# EasyEDA Pro project ProPrj_Retro-boy-color_2026-08-08.epro, board PCB_V2
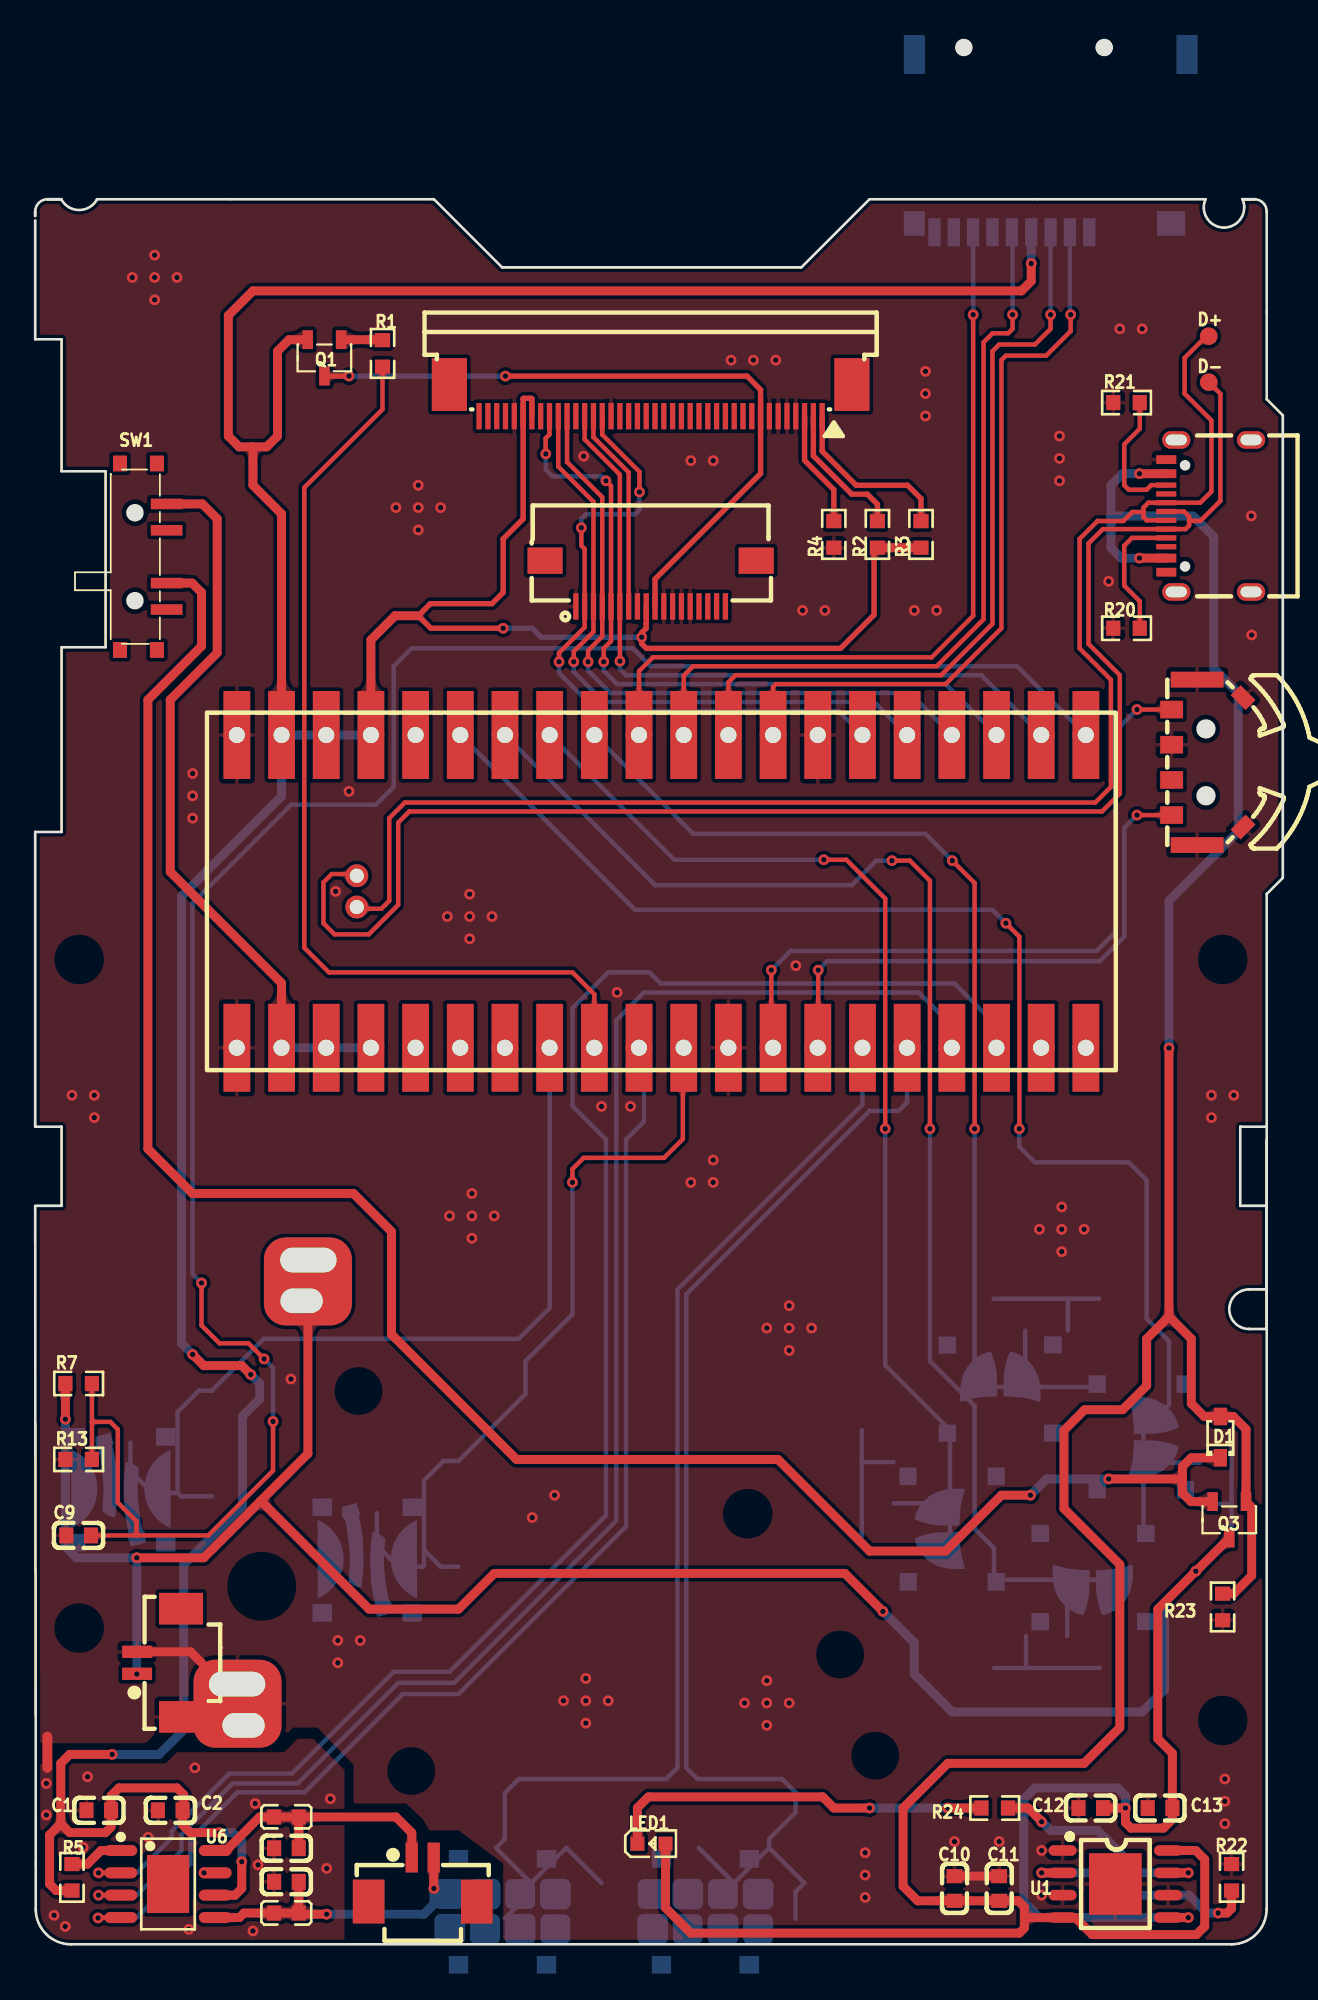
[diagram p4: board, top side]
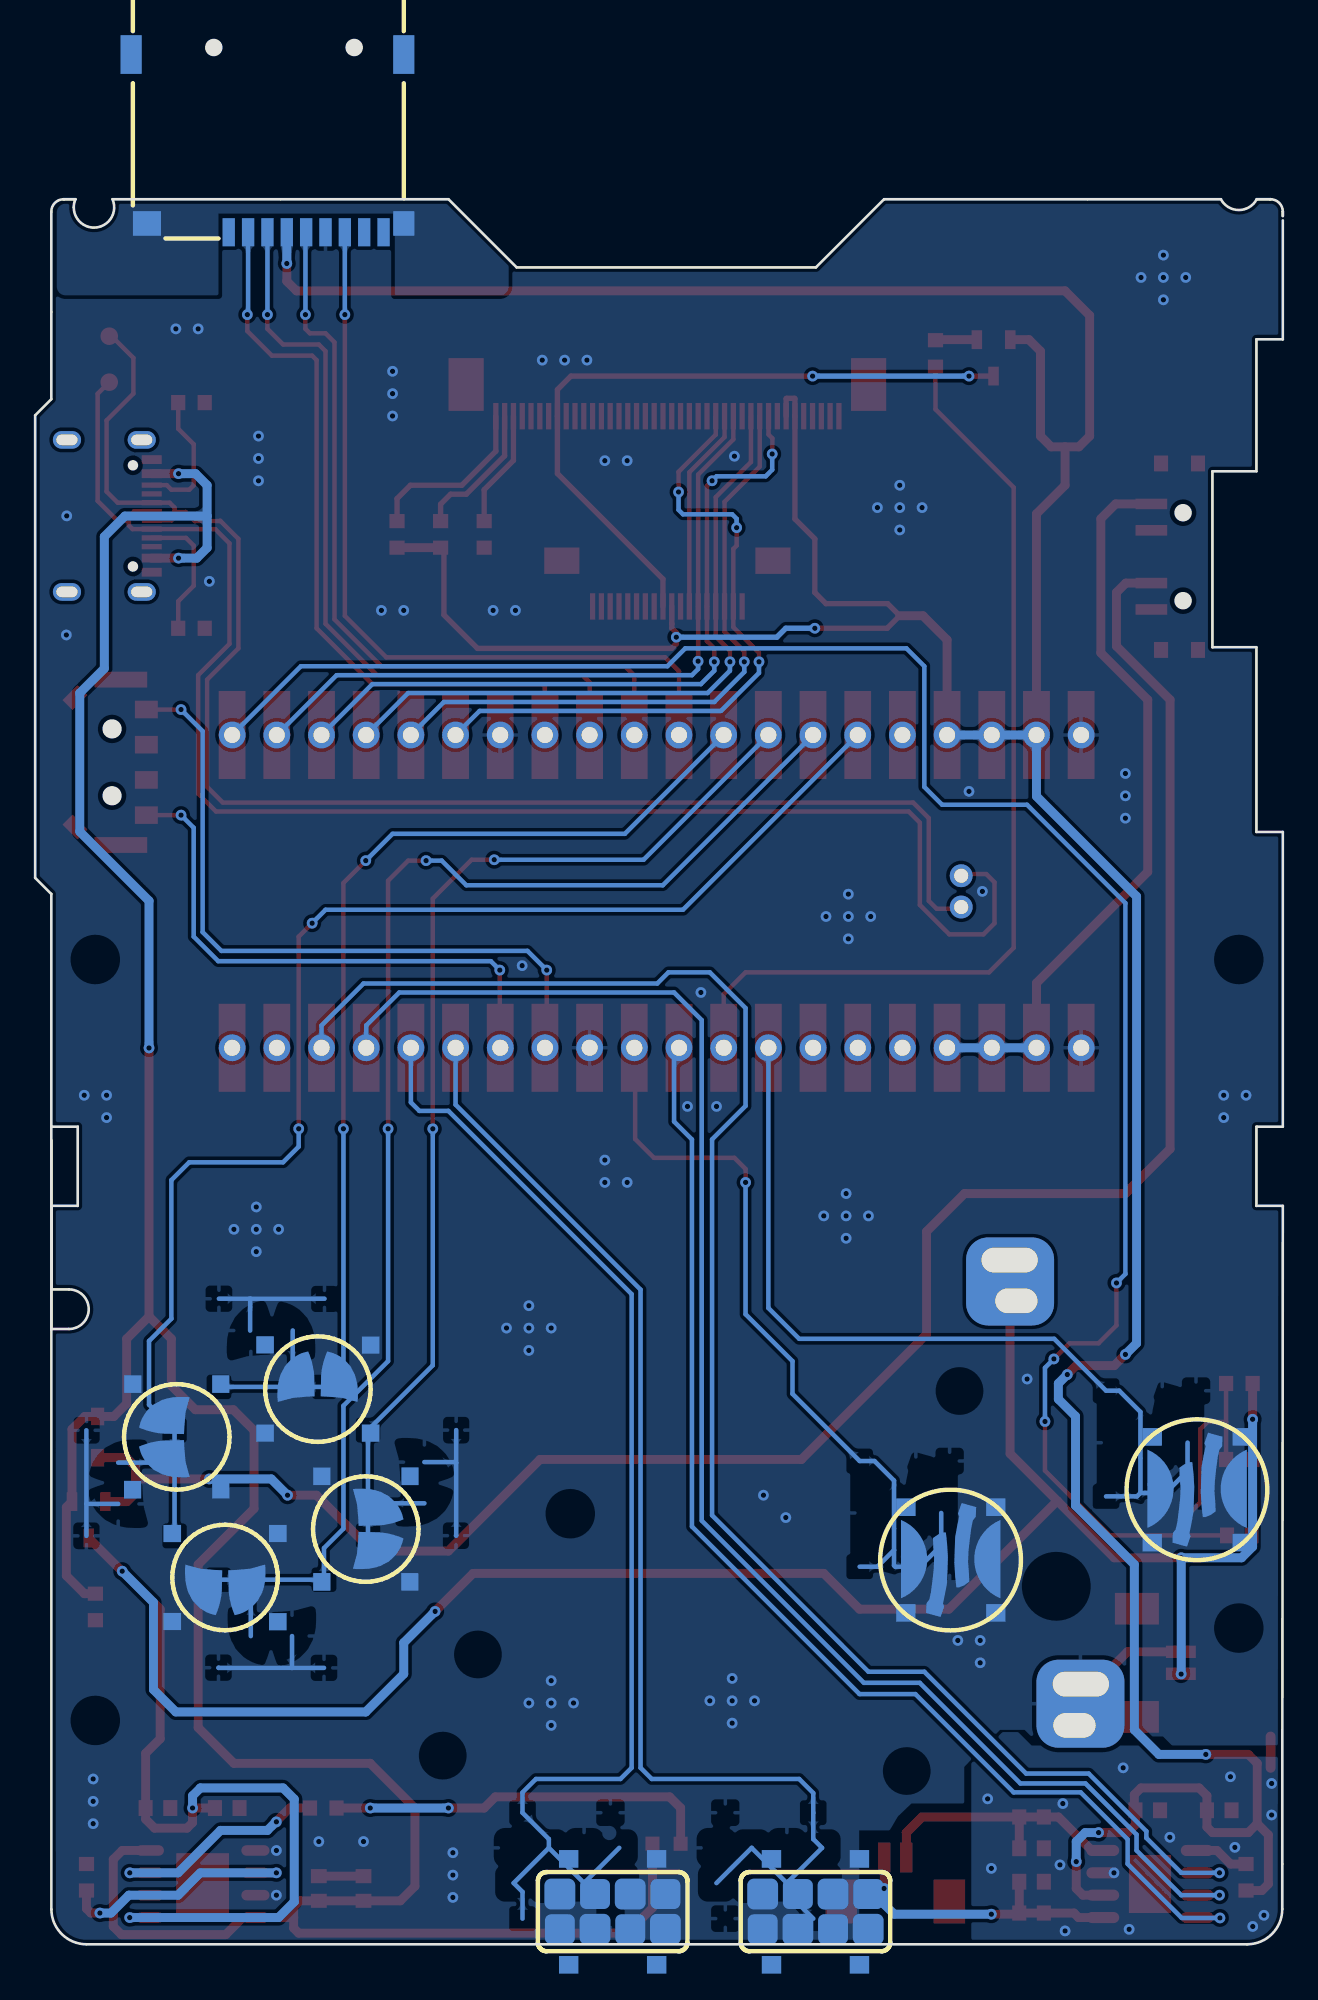
[diagram p5: board, bottom side, seen from below]

Outline 70.92 x 108.31 mm; copper layers: Top Layer, Bottom Layer. Coordinates in mm from the lower left corner of the outline.
Outline path: 0,98.49 0,98.23 0,98.49 ; 0,98.49 arc(0.21,98.98) 0.7,99.19 ; 0.7,99.19 1.48,99.19 ; 0.7,99.19 1.48,99.19 ; 0,97.98 0,91.22 1.5,91.22 1.5,83.72 4,83.72 4,73.72 1.5,73.72 1.5,63.22 0,63.22 0,46.47 1.5,46.47 1.5,41.97 0,41.97 0.03,4.57 0.03,2 arc(0.62,0.59) 2.03,0 68,0 arc(69.41,0.59) 70,2 70,45.7 ; 1.48,99.19 arc(2.5,98.57) 3.52,99.19 22.66,99.19 26.54,95.31 43.55,95.31 47.42,99.19 66.52,99.19 arc(67.34,97.6) 68.73,98.72 arc(68.7,98.96) 68.63,99.19 ; 70,46.47 68.5,46.47 68.5,41.97 70,41.97 70,37.22 69,37.22 arc(67.88,36.1) 69,34.97 70,34.97 70,59.7 70.92,60.62 70.92,86.91 70,87.82 70,98.49 arc(69.79,98.98) 69.3,99.19 ; 68.63,99.19 69.3,99.19 ; 68.63,99.19 69.3,99.19
Stack: Top Layer 0.035mm / Dielectric1 1.51mm FR4 er 4.5 / Bottom Layer 0.035mm

## Design rules (mm)
spacing copperThickness1oz (default): track to track 0.102, other pairs 0.152 to 0.3
spacing copperThickness2oz: track to track 0.203, other pairs 0.152 to 0.3
spacing Plane_innerPlane: track to track 0.102, other pairs 0.152 to 0.3
spacing Copper_copperRegion: track to track 0.102, other pairs 0.152 to 0.3
spacing Copper_加固: track to track 0.102, other pairs 0.152 to 0.3
track width copperThickness1oz (default): min 0.127, default 0.254, max 2.54
track width copperThickness2oz: min 0.203, default 0.254, max 2.54
differential pair differentialPair (default): width min 0.127, default 0.254, max 2.54; gap min 0.152, default 0.152
net FIXED uses 加固
pour e961 uses Copper_加固, copperRegion_Copper_加固
pour e963 uses Copper_copperRegion, copperRegion_Copper_copperRegion
pour e979 uses Copper_copperRegion, copperRegion_Copper_copperRegion
pour e981 uses Copper_copperRegion, copperRegion_Copper_copperRegion
pour e1108 uses Copper_copperRegion, copperRegion_Copper_copperRegion

## Placement (name value [footprint] x y rotation side)
C1  10uF  [C0603]  3.61 7.62 180 top
C2  100nF  [C0603]  7.68 7.62 180 top
C3  1nF  [C0603]  14.28 5.46 0 top
C4  1nF  [C0603]  14.28 3.55 0 top
C9  100nF  [C0603]  2.47 23.24 0 top
C10  10uF  [C0603]  52.25 3.17 270 top
C11  100nF  [C0603]  54.79 3.17 270 top
C12  10uF  [C0603]  60 7.75 0 top
C13  100nF  [C0603]  63.94 7.75 0 top
D1  1N5819WS  [SOD-323_L1.8-W1.3-LS2.5-RD]  67.37 28.83 90 top
D+  -  [Test-Point-0.5mm]  66.71 91.4 0 top
D-  -  [Test-Point-0.5mm]  66.71 88.79 0 top
J1  FPC-40贴片座子/间距0.5MM/上接/抽屉式  [FPC-SMD_40P-P0.50_FPC-40-2]  34.98 87.76 180 top
LED1  NCD0603R1  [LED0603-RD_RED]  35.03 5.72 0 top
NOREF  -  [Pad_e182]  18.28 58.96 0 top
NOREF#2  -  [Pad_e179]  15.5 37.67 0 top
NOREF#3  -  [Pad_e173]  15.5 37.67 0 top
NOREF#4  -  [Pad_e175]  15.53 38.89 0 top
NOREF#5  -  [Pad_e181]  18.28 60.74 0 top
NOREF#6  -  [Pad_e177]  11.48 14.79 0 top
NOREF#7  -  [Pad_e174]  11.5 13.68 0 top
NOREF#8  -  [Pad_e178]  11.84 12.44 0 top
NOREF#9  -  [Pad_e180]  11.5 13.68 0 top
NOREF#10  -  [Pad_e176]  15.14 36.57 0 top
Q1  AO3415  [SOT-23-3_L2.9-W1.4-P1.90-LS2.5-BR]  16.44 90.17 90 top
Q3  AO3415  [SOT-23-3_L2.9-W1.4-P1.90-LS2.5-BR]  67.88 24.13 90 top
R1  1kΩ  [R0603]  19.74 90.42 270 top
R2  10kΩ  [R0603]  47.87 80.14 90 top
R3  10kΩ  [R0603]  50.35 80.14 90 top
R4  10kΩ  [R0603]  45.4 80.14 90 top
R5  10kΩ  [R0603]  2.09 3.81 90 top
R7  10kΩ  [R0603]  2.47 31.88 180 top
R13  10kΩ  [R0603]  2.47 27.56 0 top
R20  5.1kΩ  [R0603]  62.03 74.8 0 top
R21  5.1kΩ  [R0603]  62.03 87.63 0 top
R22  10kΩ  [R0603]  68 3.81 270 top
R23  10kΩ  [R0603]  67.49 19.18 90 top
R24  1kΩ  [R0603]  54.54 7.75 0 top
SW1  MSK13C02-SZ  [SW-SMD_MSK13C02-SZ]  5.95 78.87 270 top
SW1#2  -  [导电橡胶按键#2]  49.5 26.23 270 bottom
SW1#3  -  [导电橡胶按键#2]  57.47 34.18 180 bottom
SW1#4  -  [导电橡胶按键#2]  65.49 26.22 90 bottom
SW1#5  -  [导电橡胶按键#2]  57.5 18.22 0 bottom
SW2  TM-2023  [SW-SMD_TM-2023-1]  66.63 67.18 270 top
SW8  -  [导电橡胶按键]  40.72 4.48 180 bottom
SW8#2  -  [导电橡胶按键]  29.19 4.48 180 bottom
SW8#3  -  [导电橡胶按键#3]  21.5 24.47 180 bottom
SW8#4  -  [导电橡胶按键#3]  7.5 28.47 180 bottom
U1  TP4056X-42-ESOP8  [SOP-8_L4.9-W3.9-P1.27-LS6.0-TL-EP]  61.4 3.43 0 top
U3  FPC-05-18P  [FPC-SMD_18P-P0.50_XW05200-18]  34.98 77.34 180 top
U4  LCKFB-ESP32S3R8N8  [DIP-40_L20.32-W51.66-P2.54-LS15.24]  35.59 59.85 270 top
U5  HX TF-CARD H1.8  [TF-SMD_HX-TF-CARD-H1.8]  57.72 102.36 0 bottom
U6  NS4168  [ESOP-8_L4.9-W3.9-P1.27-LS6.0-BL-EP-1]  7.55 3.43 270 top
U7  ZX-MX1.25-2PWT  [CONN-SMD_2P-P1.25_MEGASTAR_ZX-MX1.25-2PWT]  22.03 3.68 180 top
U8  GBK160808T-102Y-N  [L0603]  14.28 7.24 0 top
U9  GBK160808T-102Y-N  [L0603]  14.28 1.78 0 top
U10  ZX-MX1.25-2PWT  [CONN-SMD_2P-P1.25_MEGASTAR_ZX-MX1.25-2PWT]  7.04 16 270 top
USB3  MC-107DJ  [TYPE-C-SMD_MC-107DJ]  66.7 81.19 90 top

## Footprints (pads in the part's own frame, mm; a bottom-side part is the same pattern mirrored in y, then rotated)
C0603
  rect 0.8x0.9 smd: 1(-0.7,0) 2(0.7,0)
CONN-SMD_2P-P1.25_MEGASTAR_ZX-MX1.25-2PWT
  rect 0.7x1.7 smd: 1(0.625,-1.25) 2(-0.625,-1.25)
  rect 1.8x2.5 smd: 3(-3.075,1.25) 4(3.075,1.25)
DIP-40_L20.32-W51.66-P2.54-LS15.24
  rect 5x1.524 smd: 1(-8.89,24.131) 2(-8.89,21.591) 3(-8.89,19.052) 4(-8.89,16.512) 5(-8.89,13.972) 6(-8.89,11.431) 7(-8.89,8.892) 8(-8.89,6.351) 9(-8.89,3.812) 10(-8.89,1.272) 11(-8.89,-1.268) 12(-8.89,-3.808) 13(-8.89,-6.348) 14(-8.89,-8.889) 15(-8.89,-11.428) 16(-8.89,-13.969) 17(-8.89,-16.509) 18(-8.89,-19.049) 19(-8.89,-21.588) 20(-8.89,-24.128) 21(8.89,-24.128) 22(8.89,-21.588) 23(8.89,-19.049) 24(8.89,-16.509) 25(8.89,-13.969) 26(8.89,-11.428) 27(8.89,-8.889) 28(8.89,-6.348) 29(8.89,-3.808) 30(8.89,-1.268) 31(8.89,1.272) 32(8.89,3.812) 33(8.89,6.351) 34(8.89,8.892) 35(8.89,11.431) 36(8.89,13.972) 37(8.89,16.512) 38(8.89,19.052) 39(8.89,21.591) 40(8.89,24.131)
  round 1.524 hole 0.914: 1(-8.89,24.128) 2(-8.889,21.591) 3(-8.889,19.052) 4(-8.889,16.512) 5(-8.889,13.972) 6(-8.889,11.431) 7(-8.889,8.892) 8(-8.889,6.351) 9(-8.889,3.812) 10(-8.889,1.272) 11(-8.889,-1.268) 12(-8.889,-3.808) 13(-8.889,-6.348) 14(-8.889,-8.889) 15(-8.889,-11.428) 16(-8.889,-13.969) 17(-8.889,-16.509) 18(-8.889,-19.049) 19(-8.889,-21.588) 20(-8.889,-24.128) 21(8.889,-24.131) 22(8.889,-21.591) 23(8.889,-19.052) 24(8.889,-16.512) 25(8.889,-13.972) 26(8.889,-11.431) 27(8.889,-8.892) 28(8.889,-6.351) 29(8.889,-3.812) 30(8.889,-1.272) 31(8.889,1.268) 32(8.889,3.808) 33(8.889,6.348) 34(8.889,8.889) 35(8.889,11.428) 36(8.889,13.969) 37(8.889,16.509) 38(8.889,19.049) 39(8.889,21.588) 40(8.89,24.128)
ESOP-8_L4.9-W3.9-P1.27-LS6.0-BL-EP-1
  oval 0.63x1.865 smd: 1(-1.905,-2.683) 2(-0.635,-2.683) 3(0.635,-2.683) 4(1.905,-2.683) 5(1.905,2.683) 6(0.635,2.683) 7(-0.635,2.683) 8(-1.905,2.683)
  rect 3.3x2.4 smd: 9(0,0)
FPC-SMD_18P-P0.50_XW05200-18
  rect 0.3x1.5 smd: 1(4.25,1.3) 2(3.75,1.3) 3(3.25,1.3) 4(2.75,1.3) 5(2.25,1.3) 6(1.75,1.3) 7(1.25,1.3) 8(0.75,1.3) 9(0.25,1.3) 10(-0.25,1.3) 11(-0.75,1.3) 12(-1.25,1.3) 13(-1.75,1.3) 14(-2.25,1.3) 15(-2.75,1.3) 16(-3.25,1.3) 17(-3.75,1.3) 18(-4.25,1.3)
  rect 2x1.5 smd: 19(-6,-1.3) 20(6,-1.3)
FPC-SMD_40P-P0.50_FPC-40-2
  rect 0.3x1.5 smd: 1(-9.75,0.9) 2(-9.25,0.9) 3(-8.75,0.9) 4(-8.25,0.9) 5(-7.75,0.9) 6(-7.25,0.9) 7(-6.75,0.9) 8(-6.25,0.9) 9(-5.75,0.9) 10(-5.25,0.9) 11(-4.75,0.9) 12(-4.25,0.9) 13(-3.75,0.9) 14(-3.25,0.9) 15(-2.75,0.9) 16(-2.25,0.9) 17(-1.75,0.9) 18(-1.25,0.9) 19(-0.75,0.9) 20(-0.25,0.9) 21(0.25,0.9) 22(0.75,0.9) 23(1.25,0.9) 24(1.75,0.9) 25(2.25,0.9) 26(2.75,0.9) 27(3.25,0.9) 28(3.75,0.9) 29(4.25,0.9) 30(4.75,0.9) 31(5.25,0.9) 32(5.75,0.9) 33(6.25,0.9) 34(6.75,0.9) 35(7.25,0.9) 36(7.75,0.9) 37(8.25,0.9) 38(8.75,0.9) 39(9.25,0.9) 40(9.75,0.9)
  rect 2x3 smd: 41(11.44,-0.9) 42(-11.44,-0.9)
L0603
  rect 0.8x0.864 smd: 1(-0.7,0) 2(0.7,0)
LED0603-RD_RED
  rect 0.8x0.8 smd: 1(-0.799,-0.004) 2(0.799,0.004)
Pad_e173
  custom 0x0 smd far side: 9(0,0)
Pad_e174
  custom 0x0 smd far side: 10(0,0)
Pad_e175
  oval 4x1.8 hole 3.2x1.4: 9(0,0)
Pad_e176
  oval 3x1.8 hole 2.4x1.4: 9(0,0)
Pad_e177
  oval 4x1.8 hole 3.2x1.4: 9(0,0)
Pad_e178
  oval 3x1.8 hole 2.4x1.4: 9(0,0)
Pad_e179
  custom 0x0 smd: 9(0,0)
Pad_e180
  custom 0x0 smd: 10(0,0)
Pad_e181
  round 1.3 hole 0.8: 1(0,0)
Pad_e182
  round 1.3 hole 0.8: 1(0,0)
R0603
  rect 0.806x0.864 smd: 1(-0.753,0) 2(0.753,0)
SOD-323_L1.8-W1.3-LS2.5-RD
  rect 1x0.75 smd: 1(-1.173,0) 2(1.173,0)
SOP-8_L4.9-W3.9-P1.27-LS6.0-TL-EP
  oval 1.6x0.6 smd: 1(-3,1.905) 2(-3,0.635) 3(-3,-0.635) 4(-3,-1.905) 5(3,-1.905) 6(3,-0.635) 7(3,0.635) 8(3,1.905)
  rect 3x3.5 smd: 9(0,0)
SOT-23-3_L2.9-W1.4-P1.90-LS2.5-BR
  rect 1.07x0.6 smd: 1(1.035,-0.95) 2(1.035,0.95) 3(-1.035,0)
SW-SMD_MSK13C02-SZ
  rect 0.6x1.8 smd: 1(-3,1.526) 2(-1.5,1.526) 3(1.5,1.526) 4(3,1.526)
  rect 0.9x0.8 smd: 5(-5.3,0.975) 5(-5.3,-1.125) 6(5.3,0.975) 6(5.3,-1.125)
SW-SMD_TM-2023-1
  rect 1x1.3 smd: 1(-3,-2.03) 2(3,-2.03) C(-1,-2.03) T(1,-2.03)
  rect 0.9x3 smd: 3(-4.7,-0.58) 4(4.7,-0.58)
  rect 1.2x0.8 smd rot 135: 5(3.68,2.03)
  rect 1.2x0.8 smd rot 45: 6(-3.68,2.03)
Test-Point-0.5mm
  round 1 smd: 1(0,0)
TF-SMD_HX-TF-CARD-H1.8
  rect 0.7x1.6 smd: 1(2.2,5.05) 2(1.1,5.05) 3(0,5.05) 4(-1.1,5.05) 5(-2.2,5.05) 6(-3.3,5.05) 7(-4.4,5.05) 8(-5.5,5.05) 9(-6.6,5.05)
  rect 1.2x1.4 smd: 10(-7.75,4.55)
  rect 1.6x1.4 smd: 11(6.85,4.55)
  rect 1.2x2.2 smd: 12(-7.75,-5.05) 13(7.75,-5.05)
TYPE-C-SMD_MC-107DJ
  oval 1x1.6 hole 0.6x1.2: 1(-4.32,1.841) 1(-4.32,-2.409) 1(4.32,1.841) 1(4.32,-2.409)
  rect 0.5x1.14 smd: A1(-3.2,2.409) A4(-2.4,2.409) A9(2.4,2.409) A12(3.2,2.409)
  rect 0.3x1.14 smd: A5(-1.25,2.409) A6(-0.25,2.409) A7(0.25,2.409) A8(1.25,2.409) B5(1.75,2.409) B6(0.75,2.409) B7(-0.75,2.409) B8(-1.75,2.409)
导电橡胶按键
  custom 1.1x1 smd: 1(5.125,0.376) 2(0.126,0.376) 3(5.128,-5.646) 4(0.128,-5.646)
  custom 1.75x1.75 smd: 5(-0.374,-1.624) 7(3.626,-1.624) 10(1.625,-3.624) 12(5.625,-3.624)
  custom 1.7x1.7 smd: 6(1.625,-1.624) 8(5.625,-1.624) 9(-0.374,-3.624) 11(3.626,-3.624)
导电橡胶按键#2
  custom 2.114x2.872 smd: 1(1.442,-1.921) 2(3.785,-1.921)
  custom 1x0.975 smd: 3(-0.375,-0.113) 4(5.625,-0.125) 5(5.625,-5.125) 6(-0.375,-5.125)
导电橡胶按键#3
  custom 1.484x4.457 smd: 1(4.709,-2.579)
  custom 1.24x4.803 smd: 2(3.268,-1.786) 3(2.027,-3.463)
  custom 1.485x4.457 smd: 4(0.541,-2.579)
  custom 1.1x1 smd: 5(0.075,0.375) 6(5.19,0.375) 7(0.075,-5.633) 8(5.19,-5.633)

## Nets
+3V3: C1.1 C2.1 J1.34 J1.35 Q1.2 R2.1 R3.1 R5.1 U3.9 U4.17 U4.18 U4.19 U5.4 U6.6
+5V: SW1.1 U4.22 U4.23 U4.24
+5V_S: D1.1 Q3.2 SW1.3
GND: C1.2 C2.2 C3.1 C4.1 C9.1 C10.1 C11.1 C12.1 C13.1 J1.4 J1.5 J1.6 J1.7 J1.25 J1.36 NOREF#6.9 NOREF#7.10 NOREF#8.9 NOREF#9.10 R4.1 R13.1 R20.1 R21.1 R22.1 R23.1 SW1#2.1 SW1#2.3 SW1#2.4 SW1#3.1 SW1#3.3 SW1#3.4 SW1#4.1 SW1#4.3 SW1#4.4 SW1#5.1 SW1#5.3 SW1#5.4 SW2.3 SW2.4 SW2.5 SW2.6 SW2.C SW8.1 SW8.3 SW8.5 SW8.7 SW8.10 SW8.12 SW8#2.2 SW8#2.4 SW8#2.5 SW8#2.7 SW8#2.10 SW8#2.12 SW8#3.2 SW8#3.4 SW8#3.6 SW8#3.8 SW8#4.2 SW8#4.4 SW8#4.6 SW8#4.8 U1.1 U1.3 U1.6 U1.9 U3.1 U3.8 U3.11 U3.12 U3.13 U3.14 U4.7 U4.20 U4.21 U4.32 U5.6 U6.7 U10.2 U10.4 USB3.A12
VIN: C10.2 C11.2 D1.2 LED1.2 Q3.1 R23.2 U1.4 U1.8 USB3.A4 USB3.A9
18P_X+: U3.17
18P_X-: U3.15
18P_Y+: U3.18
18P_Y-: U3.16
BAT+: C12.2 C13.2 NOREF#2.9 NOREF#3.9 NOREF#4.9 NOREF#10.9 Q3.3 R7.2 U1.5 U10.1
CHIP_PU: U4.16
CS: J1.32 U3.5 U4.3
D/C: J1.30 U3.4 U4.4
DB0: J1.24
DB1: J1.23
DB2: J1.22
DB3: J1.21
DB4: J1.20
DB5: J1.19
DB6: J1.18
DB7: J1.17
DB8: J1.16
DB9: J1.15
DB10: J1.14
DB11: J1.13
DB12: J1.12
DB13: J1.11
DB14: J1.10
DB15: J1.9
FIXED: U5.10 U5.11
GPIO00: U4.25
GPIO01: C9.2 R7.1 R13.2 U4.1
GPIO02: J1.28 U3.6 U4.2
GPIO05: J1.31 U3.3 U4.5
GPIO06: J1.26 U3.2 U4.6
GPIO07: U4.8 U5.2
GPIO08: U4.9 U5.3
GPIO09: U4.10 U5.5
GPIO10: U4.11 U5.7
GPIO11: SW1#3.2 SW1#3.5 SW1#3.6 U4.12
GPIO12: SW1#2.2 SW1#2.5 SW1#2.6 U4.13
GPIO13: SW1#5.2 SW1#5.5 SW1#5.6 U4.14
GPIO14: SW1#4.2 SW1#4.5 SW1#4.6 U4.15
GPIO15: SW8.2 SW8.4 SW8.6 SW8.8 SW8.9 SW8.11 U4.36
GPIO16: SW8#2.1 SW8#2.3 SW8#2.6 SW8#2.8 SW8#2.9 SW8#2.11 U4.35
GPIO17: SW2.2 U4.34
GPIO18: SW2.1 U4.33
GPIO21: SW8#3.1 SW8#3.3 SW8#3.5 SW8#3.7 U4.31
GPIO38: SW8#4.1 SW8#4.3 SW8#4.5 SW8#4.7 U4.28
GPIO39: R1.2 U4.29
GPIO40: U4.30 U6.4
GPIO41: U4.37 U6.3
GPIO42: U4.38 U6.2
GPIO45: U4.39
GPIO46: U4.40
GPIO47: U4.27
GPIO48: U4.26
IM0: J1.3 R4.2
IM1: J1.2 R2.2
IM2: J1.1 R3.2
LEDA: J1.8 Q1.3 U3.10
NS+: C3.2 U6.8 U7.1 U8.1 U8.2
NS-: C4.2 U6.5 U7.2 U9.1 U9.2
RD: J1.29
SDO: J1.27 U3.7
TE: J1.33
USB_D+: D+.1 NOREF.1 USB3.A6 USB3.B6
USB_D-: D-.1 NOREF#5.1 USB3.A7 USB3.B7
X+: J1.38
X-: J1.40
Y+: J1.37
Y-: J1.39
$1N1508: Q1.1 R1.1
$1N4956: R5.2 U6.1
$1N7118: R21.2 USB3.B5
$1N7119: R20.2 USB3.A5
$1N8079: R22.2 U1.2
$1N8081: R24.2 U1.7
$1N8083: LED1.1 R24.1

Pads without a net: J1 41 42; SW1 2 4 5 6; SW2 T; U3 19 20; U5 1 8 9 12 13; U6 9; U7 3 4; U10 3; USB3 1 A1 A8 B8

## Via types
v1: diameter 0.61, hole 0.305, Top Layer to Bottom Layer, 172 vias

## Routing (per net, layer and track width the routed paths; a pad name or vN(x,y) marks a point on that pad's centre or on a via; arc(x,y) is an arc through that point)
+3V3: length 250.4
  Top Layer w0.305: 28.23,86.86 28.23,87.85 28.21,87.87 27.76,87.87 27.73,87.85 27.73,81.01 26.6,79.88 26.6,76.83 25.97,76.2 22.46,76.2 21.77,75.51 22.49,74.8 v1(26.6,74.8) ; U3.9 34.73,75.06 34.73,75.06 34.73,74.8 34.47,74.55 v1(34.47,74.29) 34.47,73.92 34.74,73.66 45.78,73.66 47.68,75.56 47.68,79.19
  Top Layer w0.508: 12.38,85.11 13.16,85.11 13.77,85.72 13.77,90.55 14.43,91.2 Q1.2 ; 12.38,85.11 12.38,82.93 14,81.3 U4.19 ; 12.38,85.11 11.59,85.11 10.98,85.72 10.98,92.58 12.38,93.98 56.06,93.98 56.62,94.53 v1(56.62,95.53) ; v1(12.25,32.38) 11.74,32.89 9.58,32.89 v1(8.95,33.53) ; R5.1 1.19,3.06 0.82,3.43 0.82,6.22 1.45,6.86 ; R2.1 R3.1 ; 1.45,6.86 1.45,10.29 1.96,10.79 v1(4.38,10.79) ; 1.45,6.86 1.96,6.35 3.99,6.35 4.31,6.67 C1.1 4.31,8.45 4.76,8.89 8.06,8.89 8.44,8.51 8.44,7.62 8.38,7.62 8.38,6.79 8.82,6.35 v1(10.47,6.35) ; v1(11.74,4.7) 11.74,3.17 11.36,2.79 U6.6 ; U4.17 19.08,74.14 20.45,75.51 21.77,75.51
  Bottom Layer w0.305: v1(26.6,74.8) 28.25,74.8 28.76,74.29 v1(34.47,74.29)
  Bottom Layer w0.508: v1(4.38,10.79) 7.04,10.79 8.44,12.19 8.44,21.59 11.78,24.93 11.78,30.01 12.76,30.99 12.76,31.88 v1(12.25,32.38) ; v1(56.62,95.53) U5.4 ; v1(11.74,4.7) 11.74,5.84 11.23,6.35 v1(10.47,6.35) ; v1(8.95,33.53) 8.31,34.16 8.31,59.56 14,65.25 U4.19 U4.18 U4.17
+5V: length 42.1
  Top Layer w0.508: U4.22 14,54.64 7.68,60.96 7.68,70.74 10.34,73.4 10.34,81.02 9.5,81.87 SW1.1
  Bottom Layer w0.508: U4.22 U4.23 U4.24
+5V_S: length 114.3
  Top Layer w0.508: 65.21,26.45 v1(61.02,26.45) ; 65.21,26.45 65.21,27.15 65.72,27.66 D1.1 ; 65.21,26.45 65.21,25.65 65.7,25.16 Q3.2 ; v1(56.57,25.53) 54.92,25.53 51.75,22.35 47.43,22.35 42.22,27.56 27.36,27.56 20.25,34.67 20.25,40.51 18.09,42.67 8.95,42.67 6.41,45.21 6.41,70.74 9.46,73.79 9.46,76.83 8.92,77.37 SW1.3
  Bottom Layer w0.508: v1(61.02,26.45) 57.5,26.45 v1(56.57,25.53)
GND: length 39.6
  Top Layer w0.508: C10.1 C11.1 ; 9.46,16 8.83,16.62 U10.2 ; 6.92,7.62 C2.2
  Top Layer w0.559: 0.69,10.03 0.69,11.81
  Bottom Layer w0.254: 66.2,25.03 68.01,25.03 ; 68.01,25.03 68.01,23.22 ; 68.01,25.03 68.01,29.22 ; 54.5,15.71 56.32,15.71 ; 56.32,15.71 60.49,15.71 60.5,15.72 ; 56.32,15.71 56.32,17.52 ; 46.99,29.23 46.99,27.37 ; 46.99,27.37 47.03,27.41 48.8,27.41 ; 46.99,27.37 46.99,23.24 47,23.23 ; 60.47,36.69 58.7,36.69 ; 58.7,36.69 58.7,34.89 ; 58.7,36.69 54.47,36.69
  vias: v1(0.64,9.14) v1(0.64,7.35) v1(1.07,1.65) v1(1.71,1.01) v1(2.09,48.26) v1(2.72,5.51) v1(2.98,9.52) v1(3.36,48.26) v1(3.36,46.99) v1(5.52,94.74) v1(6.42,6.08) v1(6.79,96.01) v1(6.79,94.74) v1(6.79,93.47) v1(8.06,94.74) v1(8.74,0.85) v1(8.95,66.55) v1(8.95,65.28) v1(8.95,64.01) v1(9.07,10.03) v1(9.6,4.06) v1(12.38,0.76) v1(12.5,8) v1(12.67,4.52) v1(14.54,32.13) v1(16.57,4.32) v1(16.78,8.27) v1(17.08,59.85) v1(17.2,17.27) v1(17.2,16) v1(17.84,65.53) v1(18.47,17.27) v1(20.5,81.66) v1(21.77,82.93) v1(21.77,81.66) v1(21.77,80.39) v1(23.04,81.66) v1(23.43,58.42) v1(23.55,41.4) v1(24.7,59.69) v1(24.7,58.42) v1(24.7,57.15) v1(24.82,42.67) v1(24.82,41.4) v1(24.82,40.13) v1(25.97,58.42) v1(26.09,41.4) v1(28.25,24.26) v1(29.52,25.53) v1(30.03,13.84) v1(31.17,84.58) v1(31.3,15.11) v1(31.3,13.84) v1(31.3,12.57) v1(32.19,47.62) v1(32.57,13.84) v1(33.08,54.1) v1(33.84,47.62) v1(37.27,84.33) v1(37.27,43.31) v1(38.54,84.33) v1(38.54,44.58) v1(38.54,43.31) v1(39.55,90.04) v1(40.32,13.71) v1(40.82,90.04) v1(41.59,35.03) v1(41.59,14.98) v1(41.59,13.71) v1(41.59,12.44) v1(42.09,90.04) v1(42.86,36.3) v1(42.86,35.03) v1(42.86,33.76) v1(42.86,13.71) v1(43.24,55.62) v1(43.62,75.82) v1(44.13,35.03) v1(44.89,75.82) v1(47.17,5.21) v1(47.17,3.94) v1(47.17,2.67) v1(49.97,75.82) v1(50.6,89.41) v1(50.6,88.14) v1(50.6,86.87) v1(51.24,75.82) v1(52.25,5.84) v1(54.79,5.84) v1(57.08,40.64) v1(57.21,5.33) v1(57.21,2.79) v1(58.22,85.72) v1(58.22,84.45) v1(58.22,83.18) v1(58.35,41.91) v1(58.35,40.64) v1(58.35,39.37) v1(59.62,40.64) v1(61.02,77.47) v1(61.65,91.82) v1(62.92,91.82) v1(66.86,48.26) v1(66.86,46.99) v1(67.62,9.4) v1(67.62,8.13) v1(67.62,6.86) v1(68.13,48.26) v1(69.13,81.19) v1(69.15,74.42)
VIN: length 180.3
  Top Layer w0.508: v1(62.77,78.79) USB3.A4 ; U1.8 65.97,5.33 66.48,4.82 66.48,1.01 66.02,0.55 60.08,0.55 59.11,1.52 U1.4 58.39,1.52 56.23,1.52 ; 56.23,1.52 56.23,2.12 55.88,2.47 C11.2 C10.2 50.16,2.47 49.33,3.3 49.33,7.75 51.87,10.29 59.62,10.29 61.65,12.32 61.65,21.59 58.48,24.76 58.48,29.21 59.65,30.39 61.81,30.39 63.18,31.75 63.18,34.42 64.45,35.69 ; 56.23,1.52 56.23,0.92 55.94,0.63 37.27,0.63 35.83,2.07 LED1.2 ; R23.2 68.12,19.93 69.15,20.95 69.15,24.84 Q3.1 68.83,29.27 68.1,30 D1.2 66.45,30 65.72,30.73 65.72,34.42 64.45,35.69 ; 64.45,35.69 v1(64.45,50.95) ; v1(62.77,83.59) USB3.A9
  Bottom Layer w0.508: 61.14,81.18 65.82,81.18 66.99,80.01 66.99,72.52 68.38,71.12 68.38,63.24 64.45,59.31 v1(64.45,50.95) ; 61.14,81.18 61.14,79.37 61.73,78.79 v1(62.77,78.79) ; 61.14,81.18 61.14,82.93 61.8,83.59 v1(62.77,83.59)
BAT+: length 156
  Top Layer w0.508: C12.2 v1(61.97,7.75) 61.97,6.92 62.29,6.6 64.13,6.6 64.64,7.11 C13.2 64.64,10.86 63.81,11.68 63.81,19.05 v1(65.97,21.21) 65.99,21.21 Q3.3 ; 12.8,25.19 15.5,27.89 NOREF#2.9 ; 12.8,25.19 9.58,21.97 v1(5.77,21.97) ; 12.8,25.19 12.84,25.19 18.98,19.05 24.06,19.05 26.09,21.08 46.03,21.08 v1(48.18,18.92) ; v1(1.72,29.84) R7.2 ; U1.5 65.54,1.52 v1(65.55,1.52)
  Bottom Layer w0.508: v1(1.72,29.84) 1.72,22.6 2.34,21.97 v1(5.77,21.97) 5.77,15.37 v1(5.78,15.36) ; v1(65.97,21.21) 64.19,19.43 64.19,14.48 62.92,13.21 52.13,13.21 49.97,15.37 49.97,17.14 v1(48.18,18.92) ; v1(61.97,7.75) 61.97,8.44 61.53,8.89 56.83,8.89 56.19,8.25 56.19,2.41 57.08,1.52 65.54,1.52 v1(65.55,1.52)
CS: length 41.7
  Top Layer w0.254: 29.23,86.86 29.23,85.82 29.01,85.6 29.01,84.72 v1(29.02,84.71) ; v1(32.44,83.18) 32.73,82.89 U3.5 32.73,74.08 32.32,73.66 v1(32.32,72.9)
  Bottom Layer w0.254: v1(32.32,72.9) 32.32,72.39 33.08,71.63 51.75,71.63 U4.3 ; v1(29.02,84.71) 29.02,83.81 29.39,83.44 32.19,83.44 v1(32.44,83.18)
D/C: length 37.8
  Top Layer w0.254: 30.23,86.86 30.23,84.25 32.23,82.25 U3.4 32.23,74.34 31.43,73.53 v1(31.43,72.9)
  Bottom Layer w0.254: U4.4 49.72,71.12 32.7,71.12 31.43,72.39 v1(31.43,72.9)
GPIO01: length 122.3
  Top Layer w0.254: 5.76,23.24 C9.2 ; 5.76,23.24 5.76,24.04 4.69,25.11 4.69,29.27 4.27,29.69 3.22,29.69 ; 5.76,23.24 9.84,23.24 13.52,26.92 v1(13.52,29.72) ; R7.1 3.22,29.69 ; 3.22,29.69 R13.2 ; v1(9.46,37.59) 9.46,35.18 10.47,34.16 12.12,34.16 v1(13.01,33.27)
  Bottom Layer w0.254: U4.1 55.81,72.64 34.98,72.64 33.97,73.66 21.39,73.66 20.38,72.64 20.38,65.78 19.36,64.77 14.54,64.77 8.95,59.18 8.95,38.1 v1(9.46,37.59) ; v1(13.01,33.27) 13.52,32.76 v1(13.52,29.72)
GPIO02: length 40.7
  Top Layer w0.254: v1(33.24,72.93) 33.24,73.75 33.23,73.76 U3.6 33.23,83.54 31.23,85.54 31.23,86.86
  Bottom Layer w0.254: v1(33.24,72.93) 33.24,72.48 33.59,72.13 53.78,72.13 U4.2
GPIO05: length 36.3
  Top Layer w0.254: 29.73,86.86 29.73,83.99 31.73,81.99 U3.3 31.73,74.6 30.61,73.48 v1(30.61,72.9)
  Bottom Layer w0.254: U4.5 47.69,70.61 32.32,70.61 30.61,72.31 v1(30.61,72.9)
GPIO06: length 37.9
  Top Layer w0.254: v1(29.78,72.9) 29.78,73.4 31.23,74.86 U3.2 31.23,79.31 31.05,79.5 v1(31.05,80.52) ; 32.23,86.86 32.23,85.81 34.35,83.69 v1(34.35,82.55)
  Bottom Layer w0.254: v1(34.35,82.55) 34.35,81.53 34.09,81.28 31.3,81.28 31.05,81.02 v1(31.05,80.52) ; U4.6 45.65,70.1 31.93,70.1 29.78,72.26 v1(29.78,72.9)
GPIO07: length 42.6
  Top Layer w0.254: U4.8 41.94,71.48 42.09,71.63 51.75,71.63 54.92,74.8 54.92,90.04 55.18,90.3 57.46,90.3 58.86,91.69 v1(58.86,92.63)
  Bottom Layer w0.254: v1(58.86,92.63) 58.82,92.67 U5.2
GPIO08: length 44.2
  Top Layer w0.254: v1(57.72,92.63) 57.72,91.82 56.83,90.93 54.79,90.93 54.41,90.55 54.41,75.06 51.49,72.13 39.81,72.13 39.4,71.73 U4.9
  Bottom Layer w0.254: v1(57.72,92.63) U5.3
GPIO09: length 45
  Top Layer w0.254: U4.10 36.86,72.11 37.4,72.64 51.24,72.64 53.91,75.31 53.91,91.06 54.41,91.57 55.3,91.57 55.56,91.82 v1(55.56,92.63)
  Bottom Layer w0.254: v1(55.56,92.63) 55.56,97.27 U5.5
GPIO10: length 45.7
  Top Layer w0.254: U4.11 34.32,72.36 35.11,73.15 50.96,73.15 53.32,75.51 v1(53.32,92.63)
  Bottom Layer w0.254: U5.7 v1(53.32,92.63)
GPIO11: length 63.4
  Top Layer w0.254: v1(53.4,46.35) 53.4,60.32 v1(52.13,61.59)
  Bottom Layer w0.254: v1(52.13,61.59) 50.6,63.12 37.4,63.12 U4.12 ; 60.47,31.68 56.28,31.68 ; 56.28,31.68 56.28,34.89 ; 56.28,31.68 54.47,31.68 53.4,32.76 v1(53.4,46.35)
GPIO12: length 63.9
  Top Layer w0.254: v1(48.32,46.35) 48.32,59.43 46.11,61.64 v1(44.83,61.64)
  Bottom Layer w0.254: U4.13 36.33,61.64 v1(44.83,61.64) ; 52,25.07 52,29.23 48.32,32.91 v1(48.32,46.35) ; 52,25.07 52,23.23 ; 52,25.07 48.8,25.07
GPIO13: length 79.2
  Top Layer w0.254: v1(48.7,61.59) 49.71,61.59 50.86,60.45 v1(50.86,46.35)
  Bottom Layer w0.254: 60.5,20.72 58.66,20.72 ; 58.66,20.72 54.5,20.72 54.5,22.52 53.4,23.62 53.4,30.61 50.86,33.15 v1(50.86,46.35) ; 58.66,20.72 58.66,17.52 ; U4.14 35.24,60.2 46.41,60.2 47.81,61.59 v1(48.7,61.59)
GPIO14: length 81
  Top Layer w0.254: v1(55.94,46.35) 55.94,46.36 55.94,57.27 v1(55.18,58.04)
  Bottom Layer w0.254: v1(55.94,46.35) 55.94,45.34 56.83,44.45 62.16,44.45 63.18,43.43 63.18,35.56 64.45,34.29 64.45,30.67 62.99,29.22 62.99,27.38 ; v1(55.18,58.04) 54.41,58.8 34.1,58.8 U4.15 ; 66.2,27.38 62.99,27.38 ; 62.99,27.38 62.99,23.22
GPIO15: length 68.4
  Bottom Layer w0.254: 41.72,5.48 43.72,3.48 43.22,2.98 43.22,1.46 ; 41.72,5.48 41.72,5.98 43.22,7.48 43.22,8.63 42.45,9.4 37.65,9.4 37.01,10.03 37.01,36.96 47.43,47.37 49.08,47.37 49.56,47.85 U4.36 ; 41.72,5.48 39.72,3.48 37.72,5.48
GPIO16: length 70.1
  Bottom Layer w0.254: 28.19,3.48 28.19,2.96 26.69,1.46 ; 28.19,3.48 30.19,5.48 32.19,3.48 ; 28.19,3.48 26.19,5.48 26.69,5.98 26.69,8.6 27.49,9.4 35.87,9.4 36.51,10.03 36.51,37.21 47.02,47.72 U4.35
GPIO17: length 31.8
  Top Layer w0.254: U4.34 44.51,50.98 v1(44.51,55.37) ; v1(62.63,64.18) SW2.2
  Bottom Layer w0.254: v1(44.51,55.37) 45.02,55.88 60.51,55.88 61.91,57.28 61.91,63.46 v1(62.63,64.18)
GPIO18: length 40
  Top Layer w0.254: v1(41.84,55.37) 41.84,51.06 U4.33 ; v1(62.63,70.18) SW2.1
  Bottom Layer w0.254: v1(62.63,70.18) 61.4,68.95 61.4,57.53 60.33,56.46 42.93,56.46 v1(41.84,55.37)
GPIO21: length 46.1
  Top Layer w0.254: v1(30.54,43.31) 30.54,44.07 31.17,44.7 35.74,44.7 36.81,45.77 36.81,50.91 U4.31
  Bottom Layer w0.254: 19.42,24.52 19.42,22.68 20.63,21.46 22.03,21.46 22.1,21.53 22.1,22.41 ; 22.1,22.41 23.04,21.46 24.05,21.46 ; 22.1,22.41 22.1,26.36 23.21,27.47 24.05,27.47 27.87,31.29 27.87,33.15 30.54,35.81 v1(30.54,43.31)
GPIO38: length 49.8
  Bottom Layer w0.254: 8.09,25.65 6.66,25.65 5.41,26.9 5.41,28.51 ; 8.09,25.65 8.29,25.46 10.05,25.46 ; 8.09,25.65 8.09,30.26 9.3,31.47 10.05,31.47 13,34.42 27.49,34.42 29.24,36.17 U4.28
GPIO39: length 55.5
  Top Layer w0.254: U4.29 31.78,54 30.54,55.24 16.69,55.24 15.3,56.64 15.3,82.8 19.74,87.25 R1.2
GPIO40: length 69.1
  Top Layer w0.254: U6.4 3.6,1.52 v1(3.57,1.5)
  Bottom Layer w0.254: v1(3.57,1.5) 5.75,1.5 8.82,4.57 8.82,5.97 11.49,8.63 15.3,8.63 20.89,14.22 24.06,14.22 33.59,23.75 33.59,45.75 34.6,46.76 34.6,50.68 U4.30
GPIO41: length 90.3
  Top Layer w0.254: v1(3.6,2.79) U6.3
  Bottom Layer w0.254: v1(3.6,2.79) 5.77,2.79 8.31,5.33 8.31,6.24 11.22,9.14 14.92,9.14 20.64,14.86 23.81,14.86 33.03,24.08 33.03,52.53 34.6,54.1 50.22,54.1 52.1,52.22 U4.37
GPIO42: length 95.9
  Top Layer w0.254: 54.67,50.93 U4.38 ; v1(3.6,4.06) U6.2
  Bottom Layer w0.254: U4.38 54.64,52.22 52.25,54.61 35.56,54.61 34.92,55.24 32.57,55.24 30.54,53.21 30.54,47.65 32.44,45.75 32.44,24.38 23.55,15.49 20.38,15.49 14.59,9.7 11.03,9.7 7.76,6.43 7.76,6.05 5.77,4.06 v1(3.6,4.06)
IM0: length 6.7
  Top Layer w0.305: 43.73,86.86 43.73,84.34 45.4,82.68 R4.2
IM1: length 8
  Top Layer w0.305: 44.23,86.86 44.23,84.6 46.41,82.42 47.3,82.42 47.87,81.85 R2.2
IM2: length 10
  Top Layer w0.305: 44.73,86.86 44.73,84.86 46.67,82.93 49.59,82.93 50.35,82.17 R3.2
LEDA: length 39.9
  Top Layer w0.305: U3.10 35.23,77.6 41.23,83.6 41.23,88.36 40.46,89.13 v1(26.73,89.13) ; 16.44,89.13 v1(17.84,89.13)
  Bottom Layer w0.305: v1(17.84,89.13) v1(26.73,89.13)
NS+: length 15.5
  Top Layer w0.508: C3.2 U8.2 ; U8.2 U8.1 12.76,7.24 10.85,5.33 U6.8 ; U8.2 20.5,7.24 21.4,6.34 U7.1
NS-: length 17.2
  Top Layer w0.508: U7.2 22.65,3.18 v1(22.66,3.17) ; v1(16.57,1.71) 15.05,1.71 U9.2 ; U9.2 U9.1 11.87,1.78 11.61,1.52 U6.5 ; U9.2 C4.2
  Bottom Layer w0.508: v1(22.66,3.17) 22.66,2.28 22.09,1.71 v1(16.57,1.71)
SDO: length 11.6
  Top Layer w0.254: 31.73,86.86 31.73,85.67 33.73,83.67 U3.7
USB_D+: length 83.9
  Top Layer w0.254: USB3.A6 63.18,80.94 63,81.12 63,81.41 ; 63,81.41 63,81.66 63.27,81.94 USB3.B6 66.22,81.94 66.86,82.57 66.86,86.61 65.34,88.14 65.34,90.17 66.57,91.4 D+.1 ; 63,81.41 62.37,81.41 61.85,80.9 60.41,80.9 60.39,80.91 59.37,79.88 59.37,73.66 61.14,71.88 61.14,65.78 60.26,64.9 21.01,64.9 20.12,64.01 20.12,59.31 19.67,58.86 18.28,58.86
USB_D-: length 88.3
  Top Layer w0.254: 65.59,80.91 65.59,81.15 65.3,81.44 USB3.A7 ; 65.59,80.91 66.23,80.91 67.37,82.04 67.37,88.13 D-.1 ; 65.59,80.91 65.59,80.64 65.38,80.44 USB3.B7 60.68,80.44 59.87,79.63 59.87,73.91 61.65,72.13 61.65,65.4 60.64,64.39 21.27,64.39 20.63,63.75 20.63,59.08 18.96,57.4 17.02,57.4 16.39,58.03 16.39,60.36 16.86,60.83 18.28,60.83 18.28,60.84
$1N1508: length 2.4
  Top Layer w0.508: R1.1 19.72,91.2 Q1.1
$1N4956: length 3.1
  Top Layer w0.508: R5.2 2.97,4.56 3.74,5.33 U6.1
$1N7118: length 7.7
  Top Layer w0.254: R21.2 62.79,86.14 61.91,85.26 61.91,82.93 62.16,82.68 63.18,82.68 63.44,82.94 USB3.B5
$1N7119: length 7.6
  Top Layer w0.254: USB3.A5 62.34,79.94 61.91,79.5 61.91,77.21 62.79,76.33 R20.2
$1N8079: length 14.1
  Top Layer w0.508: v1(67.24,1.78) 67.75,1.78 68,2.03 R22.2 ; U1.2 v1(57.21,4.06)
  Bottom Layer w0.508: v1(57.21,4.06) 61.53,4.06 62.8,2.79 65.59,2.79 66.61,1.78 v1(67.24,1.78)
$1N8081: length 12.9
  Top Layer w0.508: v1(65.54,4.06) U1.7 ; R24.2 56.45,7.75 57.21,6.98 v1(57.21,6.96)
  Bottom Layer w0.508: v1(65.54,4.06) 62.8,4.06 60.38,6.48 57.72,6.48 57.23,6.96 v1(57.21,6.96)
$1N8083: length 22.1
  Top Layer w0.508: v1(47.43,7.75) 45.4,7.75 44.76,8.38 34.86,8.38 34.23,7.75 LED1.1 ; v1(51.87,7.75) R24.1
  Bottom Layer w0.508: v1(47.43,7.75) v1(51.87,7.75)

## Copper pours and planes (outline as drawn; the poured copper is in the pictures)
GND on Top Layer: 27.09,-1.14 27.09,-0.38 26.6,-0.38 26.6,4.59 24.06,6.48 22.4,6.48 22.03,7.11 21.1,8 18.09,8 18.09,10.21 16.05,12.32 14.66,12.32 14.28,11.94 6.79,11.94 6.28,11.43 -0.45,11.43 -1.47,12.44 -1.47,101.34 71.05,101.34 72.32,100.07 72.32,-0.89 72.07,-1.14
GND on Top Layer: -0.96,10.29 7.42,10.29 8.06,10.92 14.15,10.92 14.92,11.68 15.81,11.68 17.58,9.9 17.58,-0.64 17.46,-0.76 -0.96,-0.76
GND on Bottom Layer: 27.11,-1.27 27.11,-0.51 24.08,-0.51 24.08,6.48 22.35,6.48 21.87,7.27 21.11,8 18.11,8 18.11,10.08 16.06,12.19 14.68,12.19 14.3,11.81 6.81,11.81 6.3,11.3 -0.43,11.3 -1.45,12.32 -1.45,101.22 71.07,101.22 72.34,99.95 72.34,-1.02 72.08,-1.27
GND on Bottom Layer: -0.83,10.67 7.55,10.67 8.19,11.3 14.28,11.3 15.04,12.06 15.93,12.06 17.71,10.29 17.71,-0.26 17.58,-0.38 -0.83,-0.38
FIXED on Bottom Layer: 69.69,94.22 69.54,93.87 69.19,93.72 60.5,93.72 60.5,98.37 50.48,98.37 50.48,93.72 44.5,93.72 44.15,93.87 44,94.22 44,98.43 44.15,98.79 44.5,98.93 69.19,98.93 69.54,98.79 69.69,98.43

Small or netless copper shapes (teardrops, artwork), in the pictures only: 180 on Top Layer, 165 on Bottom Layer
